# EAGLE design sousvide (EAGLE 6.4)
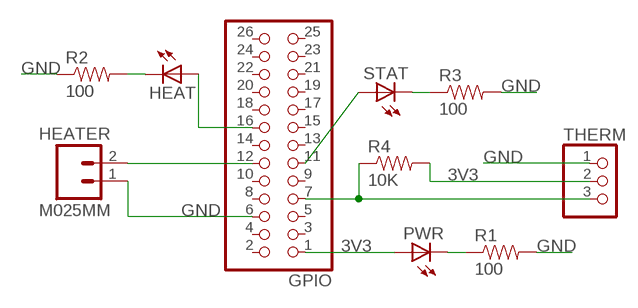
[diagram p0: schematic, sheet 1]

## Parts
GPIO  PINHD-2X13  [2X13]
HEAT  LED1206  [LED-1206]
HEATER  M025MM  [SCREWTERMINAL-5MM-2]
PWR  LED1206  [LED-1206]
R1  100  RESISTOR1206  [1206]
R2  100  RESISTOR1206  [1206]
R3  100  RESISTOR1206  [1206]
R4  10K  RESISTOR1206  [1206]
STAT  LED1206  [LED-1206]
THERM  PINHD-1X3  [1X03]

## Nets
3V3: GPIO.1 PWR.A R4.2 THERM.2
GND: GPIO.6 HEATER.1 R1.2 R2.1 R3.2 THERM.1
N$1: PWR.C R1.1
N$2: GPIO.12 HEATER.2
N$3: R3.1 STAT.C
N$4: GPIO.16 HEAT.A
N$5: HEAT.C R2.2
N$6: GPIO.11 STAT.A
N$9: GPIO.7 R4.1 THERM.3
Unconnected: GPIO.2 GPIO.3 GPIO.4 GPIO.5 GPIO.8 GPIO.9 GPIO.10 GPIO.13 GPIO.14 GPIO.15 GPIO.17 GPIO.18 GPIO.19 GPIO.20 GPIO.21 GPIO.22 GPIO.23 GPIO.24 GPIO.25 GPIO.26

## Library data of the parts
GPIO = pinhead:PINHD-2X13: PIN HEADER
HEAT PWR STAT = SparkFun-LED:LED: LEDs Standard schematic elements and footprints for 5mm, 3mm, 1206, and 0603 sized LEDs. 5mm - Spark Fun Electronics SKU : COM-00529 (and others)
HEATER = SparkFun-Connectors:M02: Standard 2-pin 0.1" header. Use with - straight break away headers ( PRT-00116) - right angle break away headers (PRT-00553) - swiss pins (PRT-00743) - machine pins (PRT-00117) - female headers (PRT-00115) Molex polarized connector foot print use with: PRT-08233 with associated crimp pins and housings. 2.54_SCREWTERM for use with PRT-10571. 3.5mm Screw Terminal footprints for PRT-08084 5mm Screw Terminal footprints for use with PRT-08433
R1 R3 R4 = SparkFun-Passives:RESISTOR: Resistor Basic schematic elements and footprints for 0603, 1206, and PTH resistors.
R2 = SparkFun-Resistors:RESISTOR: Resistor Basic schematic elements and footprints for 0603, 1206, and PTH resistors.
THERM = pinhead:PINHD-1X3: PIN HEADER

## Board
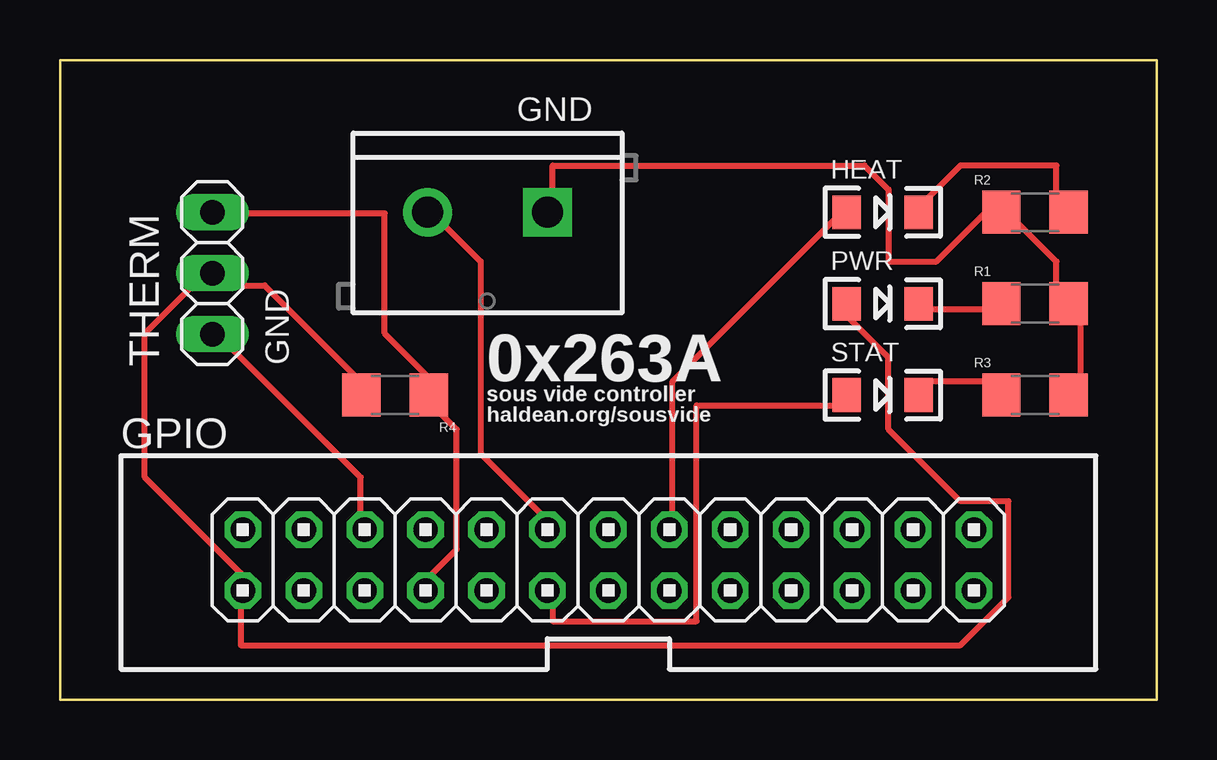
[diagram p1: board, top side]
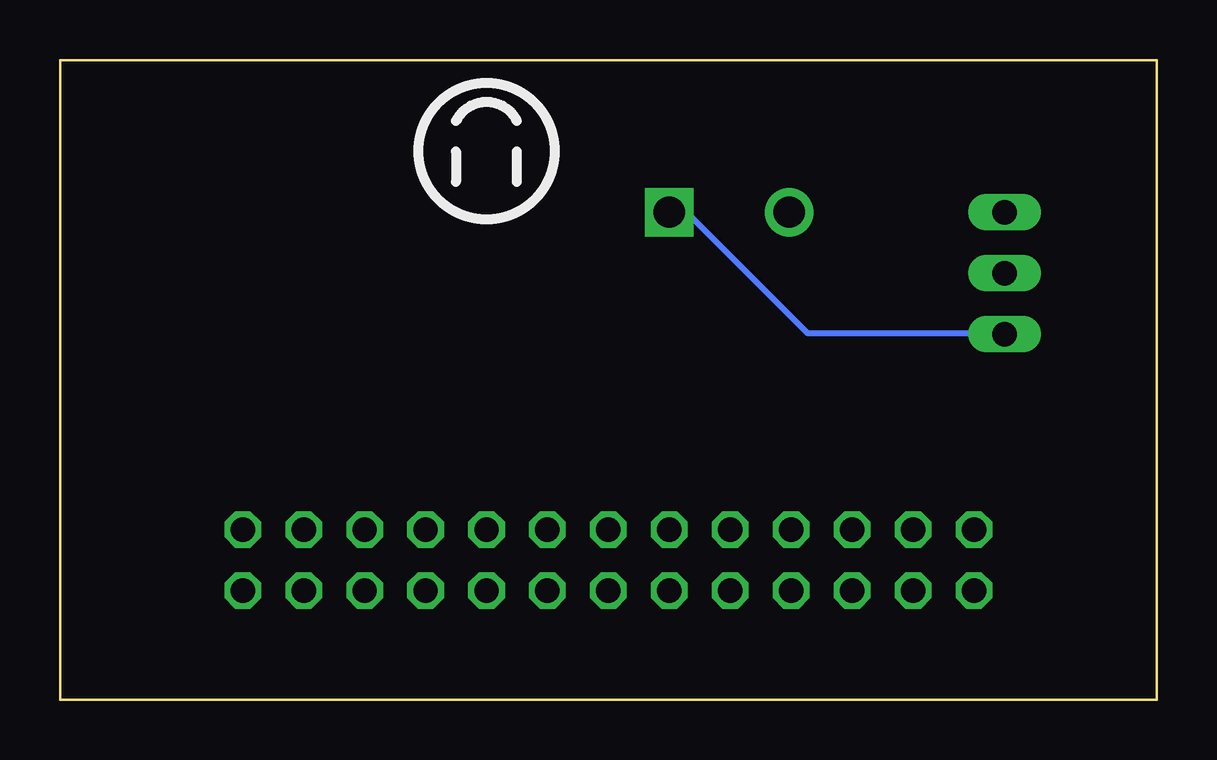
[diagram p2: board, bottom side, seen from below]

Size 45.72 x 26.67 mm. Coordinates in mm from the lower left corner, seen from the top.
Outline: 0,26.67 45.72,26.67 45.72,0 0,0 0,26.67
Copper layers (1*16): Top 0.035mm / dielectric 1.5mm / Bottom 0.035mm
Design rules "default": minimum track width 10mil, minimum drill 24mil, track to track 8mil, track to pad 8mil, pad to pad 8mil, via to via 8mil, smd to smd 8mil, copper to edge 40mil, drill to drill 8mil, minimum pad ring 10mil, minimum via ring 8mil, stop-mask expansion 4mil, vias tented up to drill 0mil, thermal gap 10mil

### Footprints (pad centres in the part's own frame; a part is rotated, then mirrored left to right if it is on the bottom)
2X13 = drill 1.016 octagon: 1 -15.24,-1.27; 2 -15.24,1.27; 3 -12.7,-1.27; 4 -12.7,1.27; 5 -10.16,-1.27; 6 -10.16,1.27; 7 -7.62,-1.27; 8 -7.62,1.27; 9 -5.08,-1.27; 10 -5.08,1.27; 11 -2.54,-1.27; 12 -2.54,1.27; 13 0,-1.27; 14 0,1.27; 15 2.54,-1.27; 16 2.54,1.27; 17 5.08,-1.27; 18 5.08,1.27; 19 7.62,-1.27; 20 7.62,1.27; 21 10.16,-1.27; 22 10.16,1.27; 23 12.7,-1.27; 24 12.7,1.27; 25 15.24,-1.27; 26 15.24,1.27
LED-1206 = smd 1.2 x 1.4: A -1.5,0; C 1.5,0
SCREWTERMINAL-5MM-2 = drill 1.3 pad 2.032 square: 1 0,0 | drill 1.3 pad 2.032: 2 5,0
1206 = smd 1.6 x 1.8: 1 -1.4,0; 2 1.4,0
1X03 = drill 1.016 long: 1 -2.54,0; 2 0,0; 3 2.54,0

### Placement (x,y rotation side)
GPIO  22.86,5.82 0 top
HEAT  34.29,20.32 0 top
HEATER  20.32,20.32 180 top
PWR  34.29,16.51 0 top
R1  40.64,16.51 0 top
R2  40.64,20.32 0 top
R3  40.64,12.7 0 top
R4  13.97,12.7 180 top
STAT  34.29,12.7 0 top
THERM  6.35,17.78 90 top

### Tracks (layer width: path | path; a pad name or v marks a point on that pad's centre or on a via)
3V3
  Top 0.254: R4.2 12.54,13.27 8.54,17.27 6.54,17.27 THERM.2 5.54,17.27 3.54,15.27 3.54,9.27 7.54,5.27 GPIO.1 7.54,4.27 7.54,2.27 37.54,2.27 39.54,4.27 39.54,8.27 37.54,8.27 34.54,11.27 34.54,14.27 32.54,16.27 PWR.A
GND
  Top 0.254: R3.2 42.54,13.27 42.54,16.27 R1.2 41.54,17.27 41.54,18.27 39.54,20.27 R2.1 38.54,20.27 36.54,18.27 34.54,18.27 34.54,21.27 33.54,22.27 20.54,22.27 20.54,21.27 HEATER.1 | THERM.1 6.54,15.27 12.54,9.27 12.54,7.27 GPIO.6
  Bottom 0.254: HEATER.1 19.54,20.27 14.54,15.27 6.54,15.27 THERM.1
N$1
  Top 0.254: PWR.C 35.54,16.27 38.54,16.27 R1.1
N$2
  Top 0.254: GPIO.12 20.54,7.27 17.54,10.27 17.54,18.27 15.54,20.27 HEATER.2
N$3
  Top 0.254: STAT.C 35.54,13.27 38.54,13.27 R3.1
N$4
  Top 0.254: HEAT.A 32.54,20.27 25.54,13.27 25.54,7.27 GPIO.16
N$5
  Top 0.254: HEAT.C 35.54,20.27 37.54,22.27 41.54,22.27 41.54,20.27 R2.2
N$6
  Top 0.254: STAT.A 32.54,12.27 26.54,12.27 26.54,3.27 20.54,3.27 20.54,4.27 GPIO.11
N$9
  Top 0.254: GPIO.7 15.54,5.27 16.54,6.27 16.54,11.27 15.54,12.27 R4.1 15.54,13.27 13.54,15.27 13.54,20.27 6.54,20.27 THERM.3

### Text on the board
tPlace: GND | GND | 0x263A | sous vide controller | haldean.org/sousvide